# EAGLE design mini (EAGLE 9.6.2)
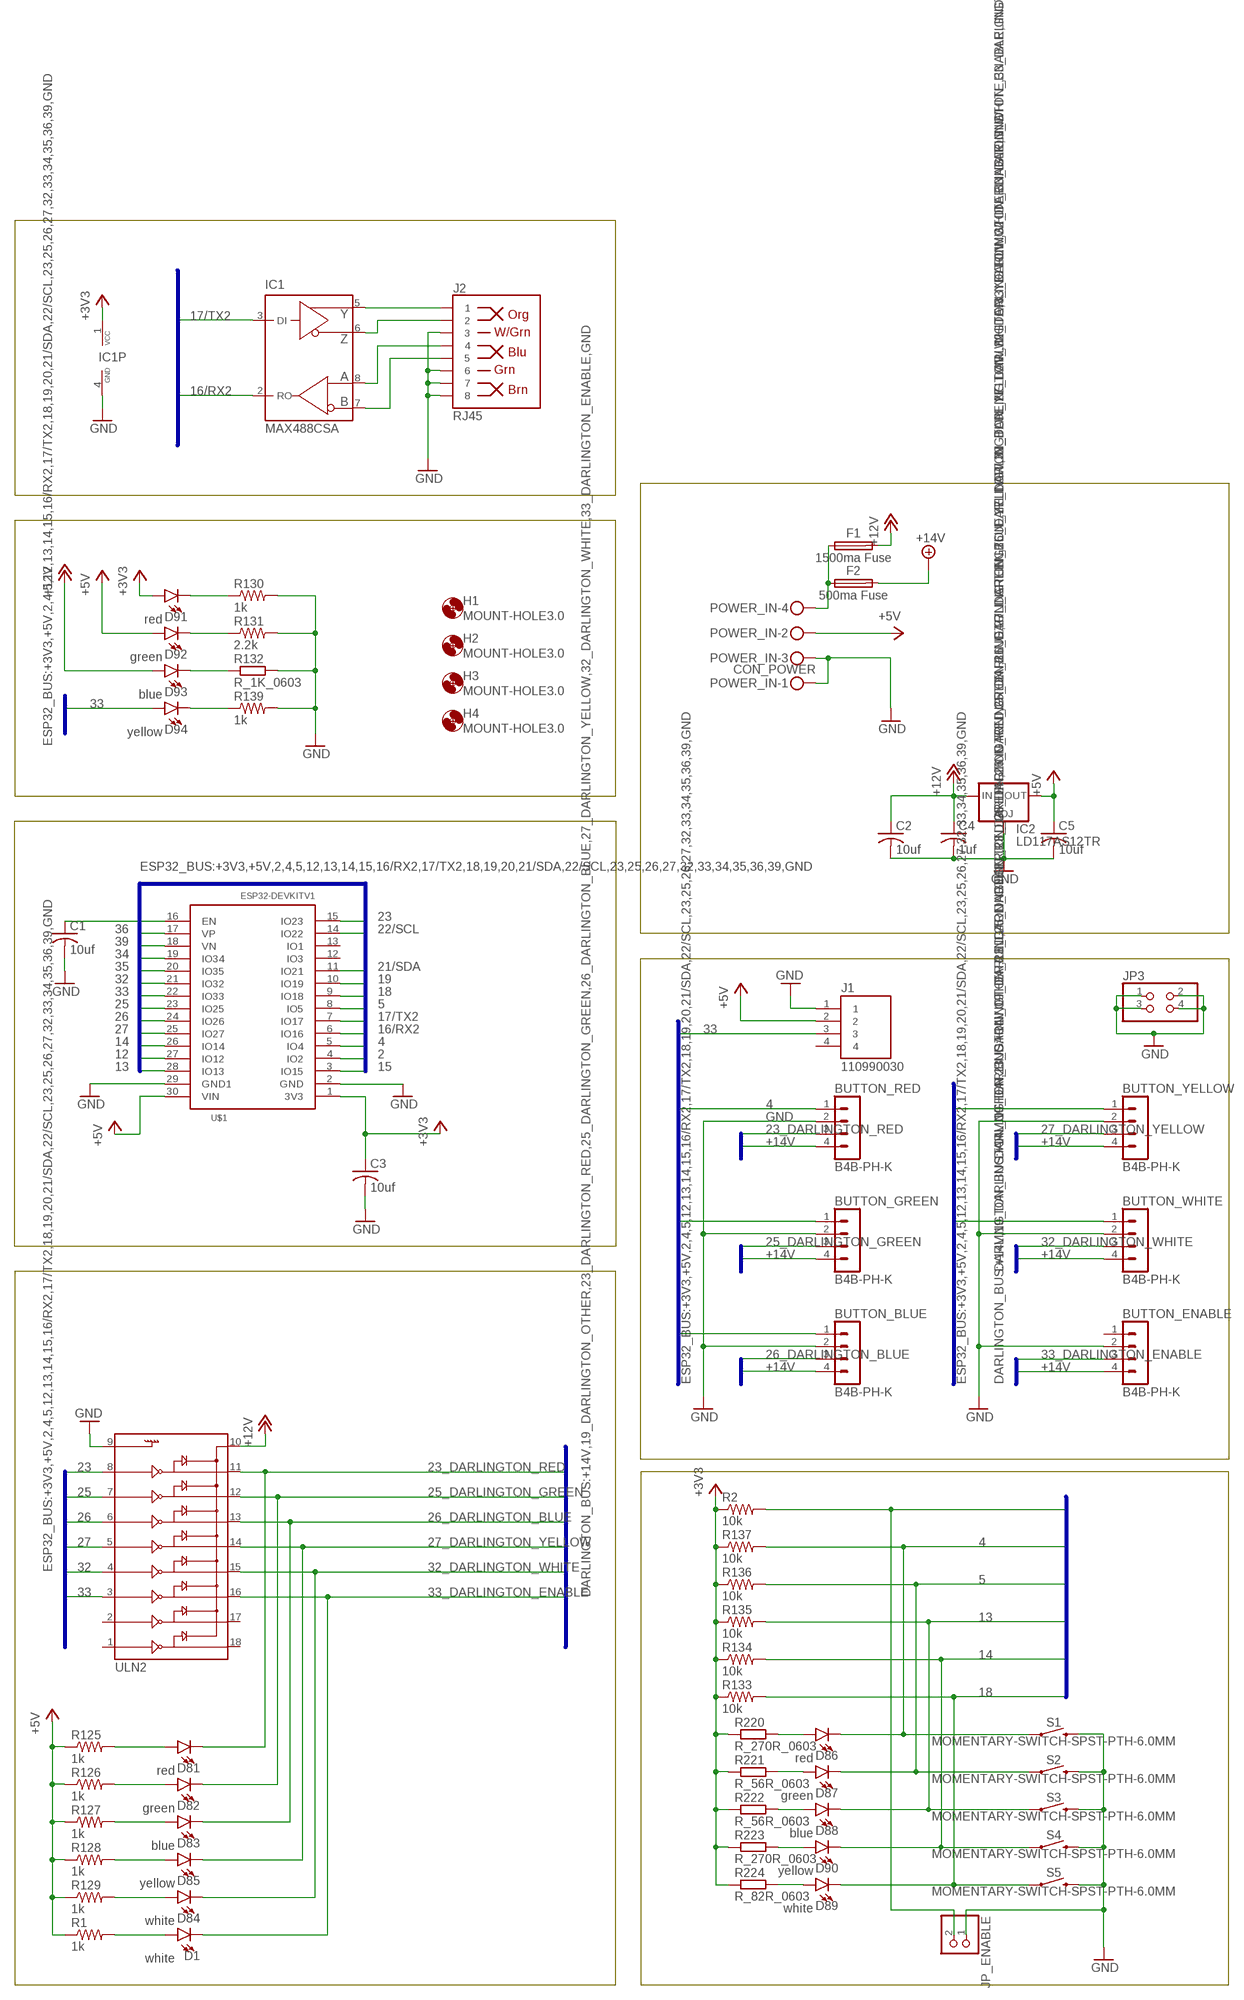
[diagram p0: schematic, sheet 1]

## Parts
BUTTON_BLUE  B4B-PH-K  [B4B-PH-K]
BUTTON_ENABLE  B4B-PH-K  [B4B-PH-K]
BUTTON_GREEN  B4B-PH-K  [B4B-PH-K]
BUTTON_RED  B4B-PH-K  [B4B-PH-K]
BUTTON_WHITE  B4B-PH-K  [B4B-PH-K]
BUTTON_YELLOW  B4B-PH-K  [B4B-PH-K]
C1  10uf  C-USC0603  [C0603]
C2  10uf  C-USC0603  [C0603]
C3  10uf  C-USC0603  [C0603]
C4  1uf  C-USC0805  [C0805]
C5  10uf  C-USC0603  [C0603]
D1  white  LED0603  [LED-0603]
D81  red  LED0603  [LED-0603]
D82  green  LED0603  [LED-0603]
D83  blue  LED0603  [LED-0603]
D84  white  LED0603  [LED-0603]
D85  yellow  LED0603  [LED-0603]
D86  red  LED0603  [LED-0603]
D87  green  LED0603  [LED-0603]
D88  blue  LED0603  [LED-0603]
D89  white  LED0603  [LED-0603]
D90  yellow  LED0603  [LED-0603]
D91  red  LED0603  [LED-0603]
D92  green  LED0603  [LED-0603]
D93  blue  LED0603  [LED-0603]
D94  yellow  LED0603  [LED-0603]
F1  1500ma Fuse  MF-MSMF-STYLE2_1  [FUSC4632X160]
F2  500ma Fuse  MF-MSMF-STYLE2_1  [FUSC4632X160]
H1  MOUNT-HOLE3.0  [3,0]
H2  MOUNT-HOLE3.0  [3,0]
H3  MOUNT-HOLE3.0  [3,0]
H4  MOUNT-HOLE3.0  [3,0]
IC1  MAX488CSA  [SO08]
IC2  LD117AS12TR  [SOT223]
J1  110990030  [SEEED_110990030]
J2  RJ45  RJ45-8  [RJ45-8]
JP3  PINHD-2X2  [2X02]
JP_ENABLE  PINHD-1X2  [1X02]
POWER_IN  CON_POWER  MKDSN1,5/4-5,08  [MKDSN1,5/4-5,08]
R1  1k  R-US_R0603  [R0603]
R2  10k  R-US_R0603  [R0603]
R125  1k  R-US_R0603  [R0603]
R126  1k  R-US_R0603  [R0603]
R127  1k  R-US_R0603  [R0603]
R128  1k  R-US_R0603  [R0603]
R129  1k  R-US_R0603  [R0603]
R130  1k  R-US_R0603  [R0603]
R131  2.2k  R-US_R0603  [R0603]
R132  R_1K_0603  [R0603]
R133  10k  R-US_R0603  [R0603]
R134  10k  R-US_R0603  [R0603]
R135  10k  R-US_R0603  [R0603]
R136  10k  R-US_R0603  [R0603]
R137  10k  R-US_R0603  [R0603]
R139  1k  R-US_R0603  [R0603]
R220  R_270R_0603  [R0603]
R221  R_56R_0603  [R0603]
R222  R_56R_0603  [R0603]
R223  R_270R_0603  [R0603]
R224  R_82R_0603  [R0603]
S1  MOMENTARY-SWITCH-SPST-PTH-6.0MM  [TACTILE_SWITCH_PTH_6.0MM]
S2  MOMENTARY-SWITCH-SPST-PTH-6.0MM  [TACTILE_SWITCH_PTH_6.0MM]
S3  MOMENTARY-SWITCH-SPST-PTH-6.0MM  [TACTILE_SWITCH_PTH_6.0MM]
S4  MOMENTARY-SWITCH-SPST-PTH-6.0MM  [TACTILE_SWITCH_PTH_6.0MM]
S5  MOMENTARY-SWITCH-SPST-PTH-6.0MM  [TACTILE_SWITCH_PTH_6.0MM]
U$1  ESP32DEVKITV1  [ESP32-DEVKITV1]
ULN2  ULN2803SOICW  [SO18L]

## Nets
2: U$1.4(IO2)
4: BUTTON_RED.1 D86.C R137.2 S1.1 U$1.5(IO4)
5: BUTTON_GREEN.1 D87.C R136.2 S2.1 U$1.8(IO5)
12: U$1.27(IO12)
13 [3V3]: BUTTON_BLUE.1 D88.C R135.2 S3.1 U$1.28(IO13)
14: BUTTON_YELLOW.1 D90.C R134.2 S4.1 U$1.26(IO14)
15: U$1.3(IO15)
16/RX2: IC1.2(RO) U$1.6(IO16)
17/TX2: IC1.3(DI) U$1.7(IO17)
18: BUTTON_WHITE.1 D89.C R133.2 S5.1 U$1.9(IO18)
19: JP_ENABLE.2 R2.2 U$1.10(IO19)
21/SDA: U$1.11(IO21)
22/SCL: U$1.14(IO22)
23: U$1.15(IO23) ULN2.8
23_DARLINGTON_RED: BUTTON_RED.3 D81.C ULN2.11
25: U$1.23(IO25) ULN2.7
25_DARLINGTON_GREEN: BUTTON_GREEN.3 D82.C ULN2.12
26: U$1.24(IO26) ULN2.6
26_DARLINGTON_BLUE: BUTTON_BLUE.3 D83.C ULN2.13
27: U$1.25(IO27) ULN2.5
27_DARLINGTON_YELLOW: BUTTON_YELLOW.3 D85.C ULN2.14
32: U$1.21(IO32) ULN2.4
32_DARLINGTON_WHITE: BUTTON_WHITE.3 D84.C ULN2.15
33: D94.A J1.3 U$1.22(IO33) ULN2.3
33_DARLINGTON_ENABLE: BUTTON_ENABLE.3 D1.C ULN2.16
34: U$1.19(IO34)
35: U$1.20(IO35)
36: U$1.17(VP)
39: U$1.18(VN)
+3V3 [3V3]: C3.1 D91.A IC1.1(VCC) R2.1 R133.1 R134.1 R135.1 R136.1 R137.1 R220.1 R221.1 R222.1 R223.1 R224.1 U$1.1(3V3)
+5V [5V]: C5.1 D92.A IC2.4(OUT) J1.2 POWER_IN.2 R1.1 R125.1 R126.1 R127.1 R128.1 R129.1 U$1.30(VIN)
+12V [12V]: C2.1 C4.1 D93.A F1.2 IC2.3(IN) ULN2.10
+14V [12V]: BUTTON_BLUE.4 BUTTON_ENABLE.4 BUTTON_GREEN.4 BUTTON_RED.4 BUTTON_WHITE.4 BUTTON_YELLOW.4 F2.2
GND [GND]: BUTTON_BLUE.2 BUTTON_ENABLE.2 BUTTON_GREEN.2 BUTTON_RED.2 BUTTON_WHITE.2 BUTTON_YELLOW.2 C1.2 C2.2 C3.2 C4.2 C5.2 IC1.4(GND) IC2.1(ADJ) J1.1 J2.3 J2.6 J2.7 J2.8 JP3.1 JP3.2 JP3.3 JP3.4 JP_ENABLE.1 POWER_IN.1 POWER_IN.3 R130.2 R131.2 R132.2 R139.2 S1.3 S2.3 S3.3 S4.3 S5.3 U$1.2(GND) U$1.29(GND1) ULN2.9
N$1: C1.1 U$1.16(EN)
N$2: D1.A R1.2
N$3: IC1.5(Y) J2.1
N$4: IC1.6(Z) J2.2
N$5: IC1.8(A) J2.4
N$6: IC1.7(B) J2.5
N$151: D84.A R129.2
N$152: D85.A R128.2
N$153: D83.A R127.2
N$154: D82.A R126.2
N$155: D81.A R125.2
N$156: D91.C R130.1
N$157: D92.C R131.1
N$158: D93.C R132.1
N$159: D94.C R139.1
N$320: D86.A R220.2
N$321: D87.A R221.2
N$322: D88.A R222.2
N$323: D90.A R223.2
N$324: D89.A R224.2
N$346 [12V]: F1.1 F2.1 POWER_IN.4
Unconnected: BUTTON_ENABLE.1 J1.4 U$1.12(IO3) U$1.13(IO1) ULN2.1 ULN2.2 ULN2.17 ULN2.18

## Buses
ESP32_BUS:+3V3,+5V,2,4,5,12,13,14,15,16/RX2,17/TX2,18,19,20,21/SDA,22/SCL,23,25,26,27,32,33,34,35,36,39,GND
DARLINGTON_BUS:+14V,19_DARLINGTON_OTHER,23_DARLINGTON_RED,25_DARLINGTON_GREEN,26_DARLINGTON_BLUE,27_DARLINGTON_YELLOW,32_DARLINGTON_WHITE,33_DARLINGTON_ENABLE,GND

## Library data of the parts
BUTTON_BLUE BUTTON_ENABLE BUTTON_GREEN BUTTON_RED BUTTON_WHITE BUTTON_YELLOW = con-jst-ph:B4B-PH-K: HEADER
C1-C3 C5 = rcl:C-US: CAPACITOR, American symbol; LCSC_PART: C19702; SPICEPREFIX: C
C4 = rcl:C-US: CAPACITOR, American symbol; LCSC_PART: C15849; SPICEPREFIX: C
D1 D84 D89 = SparkFun-LED:LED: LED (Generic) Standard schematic elements and footprints for 5mm, 3mm, 1206, and 0603 sized LEDs. Generic LEDs with no color specified.; LCSC_PART: C2290
D81 D86 D91 = SparkFun-LED:LED: LED (Generic) Standard schematic elements and footprints for 5mm, 3mm, 1206, and 0603 sized LEDs. Generic LEDs with no color specified.; LCSC_PART: C2286
D82 D87 D92 = SparkFun-LED:LED: LED (Generic) Standard schematic elements and footprints for 5mm, 3mm, 1206, and 0603 sized LEDs. Generic LEDs with no color specified.; LCSC_PART: C72043
D83 D88 D93 = SparkFun-LED:LED: LED (Generic) Standard schematic elements and footprints for 5mm, 3mm, 1206, and 0603 sized LEDs. Generic LEDs with no color specified.; LCSC_PART: C72041
D85 D90 D94 = SparkFun-LED:LED: LED (Generic) Standard schematic elements and footprints for 5mm, 3mm, 1206, and 0603 sized LEDs. Generic LEDs with no color specified.; LCSC_PART: C72038
F1 = Fuse:MF-MSMF: PTC Resettable Fuses Datasheet <https://www.bourns.com/docs/Product-Datasheets/mfmsmf.pdf?sfvrsn=26>; CATEGORY: FUSE; DESCRIPTION: PTC Resettable Fuses; LCSC_PART: C78695; MANUFACTURER: BOURNS; MPN: MF-MSMF; OPERATING_TEMPERATURE: -40 °C to +85 °C; PART_STATUS: Active; ROHS_COMPLIANCE: RoHS Compliant; SERIES: MF-MSMF; SUB-CATEGORY: Resettable; TYPE: PTC
F2 = Fuse:MF-MSMF: PTC Resettable Fuses Datasheet <https://www.bourns.com/docs/Product-Datasheets/mfmsmf.pdf?sfvrsn=26>; CATEGORY: FUSE; DESCRIPTION: PTC Resettable Fuses; LCSC_PART: C70113; MANUFACTURER: BOURNS; MPN: MF-MSMF; OPERATING_TEMPERATURE: -40 °C to +85 °C; PART_STATUS: Active; ROHS_COMPLIANCE: RoHS Compliant; SERIES: MF-MSMF; SUB-CATEGORY: Resettable; TYPE: PTC
H1-H4 = holes:MOUNT-HOLE: MOUNTING HOLE with drill center marker
IC1 = maxim:MAX488: RS485 TRANSEIVER Source: Data sheet <http://datasheets.maxim-ic.com/en/ds/MAX1487-MAX491.pdf>; LCSC_PART: C179693; MF: MAXIM; MPN: MAX488CSA; OC_FARNELL: 3534170; OC_NEWARK: 34C3921
IC2 = v-reg:LD117A?*: Low drop fixed and adjustable positive voltage regulators 1 A Source: http://www.st.com/stonline/products/literature/ds/7194/ld1117axx.pdf; LCSC_PART: C6187; PRICE: 0.5
J1 = GROVE 2MM 4PIN VERT CONN:110990030: Check availability <https://pricing.snapeda.com/parts/110990030/Seeed%20Technology/view-part?ref=eda>; AVAILABILITY: In Stock; CHECK_PRICES: https://www.snapeda.com/parts/110990030/Seeed+Studio/view-part/?ref=eda; DESCRIPTION: GROVE 2MM 4PIN VERT CONN 10PCS; MF: Seeed Technology; MP: 110990030; PACKAGE: None; PRICE: None; SNAPEDA_LINK: https://www.snapeda.com/parts/110990030/Seeed+Studio/view-part/?ref=snap
J2 = SparkFun-Connectors:RJ45-8: RJ45 Jack - 8 pin Simple RJ45, 8-pin connection. Commonly used for Cat5, Cat5e, and Cat6 Ethernet cables. Here is the connector we sell at SparkFun: RJ45 8-Pin Connector <https://www.sparkfun.com/products/643> (PRT-00643) Datasheet <https://cdn.sparkfun.com/datasheets/Prototyping/04908.pdf> It is used on this SparkFun product: SparkFun RJ45 Breakout <https://www.sparkfun.com/products/716> (BOB-00716) Note, you may also be interested in the "MAGJACK" version of this. It is basically a RJ45 connector, but also has some status LEDs built into the connector housing. You can check that out in this library at the device named "MAGJACK.dev" and see these products online: RJ45 Ethernet MagJack-Compatible <https://www.sparkfun.com/products/8534> (PRT-08534) SparkFun RJ45 MagJack Breakout <https://www.sparkfun.com/products/13021> (BOB-13021); PROD_ID: CONN-08506; SF_ID: PRT-00643
JP3 = pinhead:PINHD-2X2: PIN HEADER
JP_ENABLE = pinhead:PINHD-1X2: PIN HEADER
POWER_IN = con-phoenix-508-jm:MKDSN1,5/4-5,08: MKDSN 1,5/ 4-5,08 Printklemme Nennstrom: 13,5 A Nennspannung: 250 V Rastermaß: 5,08 mm Polzahl: 4 Anschlussart: Schraubanschluss Montage: Löten Anschlussrichtung Leiter/Platine: 0 ° Artikelnummer: 1729144 Source: http://eshop.phoenixcontact.com .. 1729144.pdf
R1 R125-R130 R139 = rcl:R-US_: RESISTOR, American symbol; LCSC_PART: C21190; SPICEPREFIX: R
R2 R133-R137 = rcl:R-US_: RESISTOR, American symbol; LCSC_PART: C25804; SPICEPREFIX: R
R131 = rcl:R-US_: RESISTOR, American symbol; LCSC_PART: C4190; SPICEPREFIX: R
R132 = JLC PCB Basic Parts_loc:R_: Resistor General purpose SMD Resistor; LCSC_DATASHEET: https://datasheet.lcsc.com/lcsc/2110252030_UNI-ROYAL-Uniroyal-Elec-0603WAF1001T5E_C21190.pdf; LCSC_PART: C21190; LCSC_ROTATION_CCW: 0; LCSC_STOCK: 5175299; PROPERTIES: ±1% 1/10W Thick Film Resistors 75V ±100ppm -55°C~+155°C 1kOhm 0603 ROHS
R220 R223 = JLC PCB Basic Parts_loc:R_: Resistor General purpose SMD Resistor; LCSC_DATASHEET: https://datasheet.lcsc.com/lcsc/2110252130_UNI-ROYAL-Uniroyal-Elec-0603WAF2700T5E_C22966.pdf; LCSC_PART: C22966; LCSC_ROTATION_CCW: 0; LCSC_STOCK: 315292; PROPERTIES: ±1% 1/10W Thick Film Resistors 75V ±100ppm -55°C~+155°C 270Ohm 0603 ROHS
R221 R222 = JLC PCB Basic Parts_loc:R_: Resistor General purpose SMD Resistor; LCSC_DATASHEET: https://datasheet.lcsc.com/lcsc/2110252230_UNI-ROYAL-Uniroyal-Elec-0603WAF560JT5E_C25196.pdf; LCSC_PART: C25196; LCSC_ROTATION_CCW: 0; LCSC_STOCK: 82739; PROPERTIES: ±1% 1/10W Thick Film Resistors 75V ±200ppm -55°C~+155°C 56Ohm 0603 ROHS
R224 = JLC PCB Basic Parts_loc:R_: Resistor General purpose SMD Resistor; LCSC_DATASHEET: https://datasheet.lcsc.com/lcsc/2110252230_UNI-ROYAL-Uniroyal-Elec-0603WAF820JT5E_C23255.pdf; LCSC_PART: C23255; LCSC_ROTATION_CCW: 0; LCSC_STOCK: 149533; PROPERTIES: ±1% 1/10W Thick Film Resistors 75V ±100ppm -55°C~+155°C 82Ohm 0603 ROHS
S1-S5 = SparkFun-Switches:MOMENTARY-SWITCH-SPST: Momentary Switch (Pushbutton) - SPST Normally-open (NO) SPST momentary switches (buttons, pushbuttons). Variants PTH-12MM - 12mm square, through-hole Momentary Pushbutton Switch - 12mm Square <https://www.sparkfun.com/products/9190> (COM-09190) PTH-6.0MM, PTH-6.0MM-KIT - 6.0mm square, through-hole Mini Pushbutton Switch <https://www.sparkfun.com/products/97> (COM-00097) KIT package intended for soldering kit's - only one side of pads' copper is exposed. PTH-RIGHT-ANGLE-KIT - Right-angle, through-hole Right Angle Tactile Button <https://www.sparkfun.com/products/10791> - Used on SparkFun BigTime Watch Kit <https://www.sparkfun.com/products/11734> SMD-12MM - 12mm square, surface-mount Tactile Button - SMD (12mm) <https://www.sparkfun.com/products/12993> (COM-12993) Used on SparkFun PicoBoard <https://www.sparkfun.com/products/11888> SMD-4.5MM - 4.5mm Square Trackball Switch Used on SparkFun Blackberry Trackballer Breakout <https://www.sparkfun.com/products/13169> SMD-4.6MMX2.8MM - 4.60mm x 2.80mm, surface mount Used on SparkFun SAMD21 Mini Breakout <https://www.sparkfun.com/products/13664> SMD-5.2MM, SMD-5.2-REDUNDANT - 5.2mm square, surface-mount Mini Pushbutton Switch - SMD <https://www.sparkfun.com/products/8720> (COM-08720) Used on Arduino Pro Mini <https://www.sparkfun.com/products/11114> REDUNDANT package connects both switch circuits together SMD-6.0X3.5MM - 6.0 x 3.5mm, surface mount Momentary Reset Switch SMD <https://www.sparkfun.com/products/8229> (COM-08229) SMD-6.2MM-TALL - 6.2mm square, surface mount Tactile Button - SMD (6mm) <https://www.sparkfun.com/products/12992> Used on SparkFun Digital Sandbox <https://www.sparkfun.com/products/12651> SMD-RIGHT-ANGLE - Right-angle, surface mount Used on SparkFun Block for Intel® Edison - Arduino <https://www.sparkfun.com/products/13036>; PROD_ID: SWCH-08441; SF_SKU: COM-00097
U$1 = ESP32-DEVKITV1:ESP32DEVKITV1
ULN2 = SparkFun-IC-Special-Function:ULN2803: Darlington Driver(IC-07959, low stock) ULN2803 Darlington array. 500mA max per channel, 8-channel package. Spark Fun Electronics SKU : COM-00312

## Net classes
0 default: width 0.305 mm, clearance 0.305 mm
1 GND: width 0.508 mm, clearance 0.305 mm
2 12V: width 1.27 mm, clearance 0.305 mm
3 5V: width 0.508 mm, clearance 0.305 mm
4 3V3: width 0.508 mm, clearance 0.305 mm

## Board
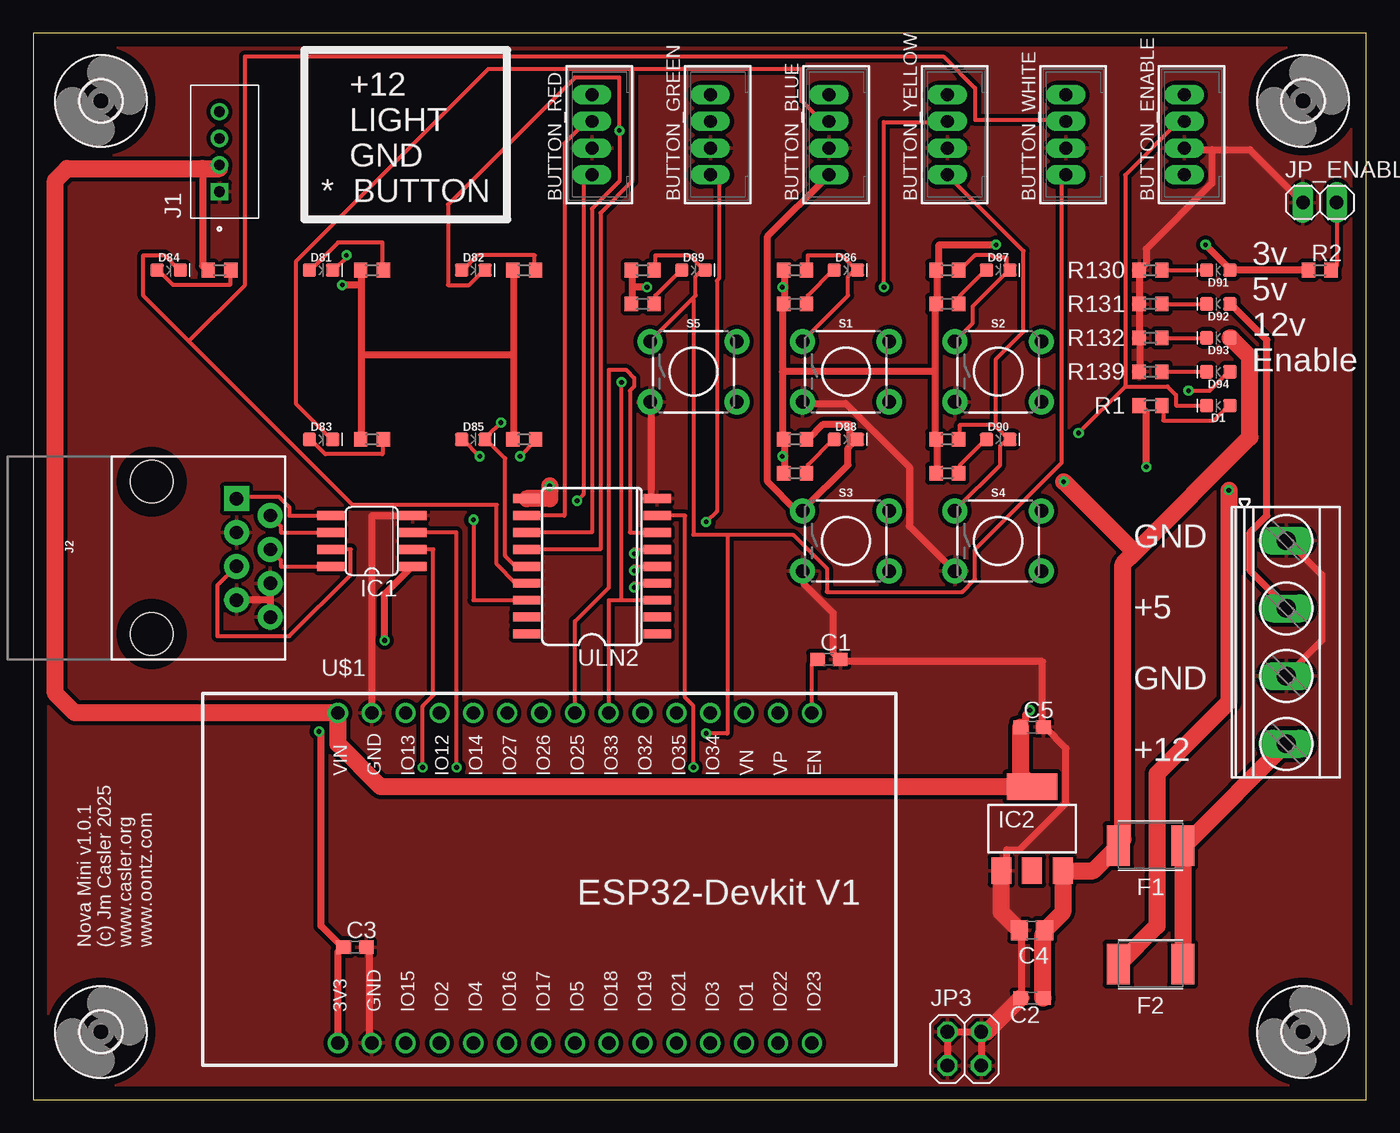
[diagram p1: board, top side]
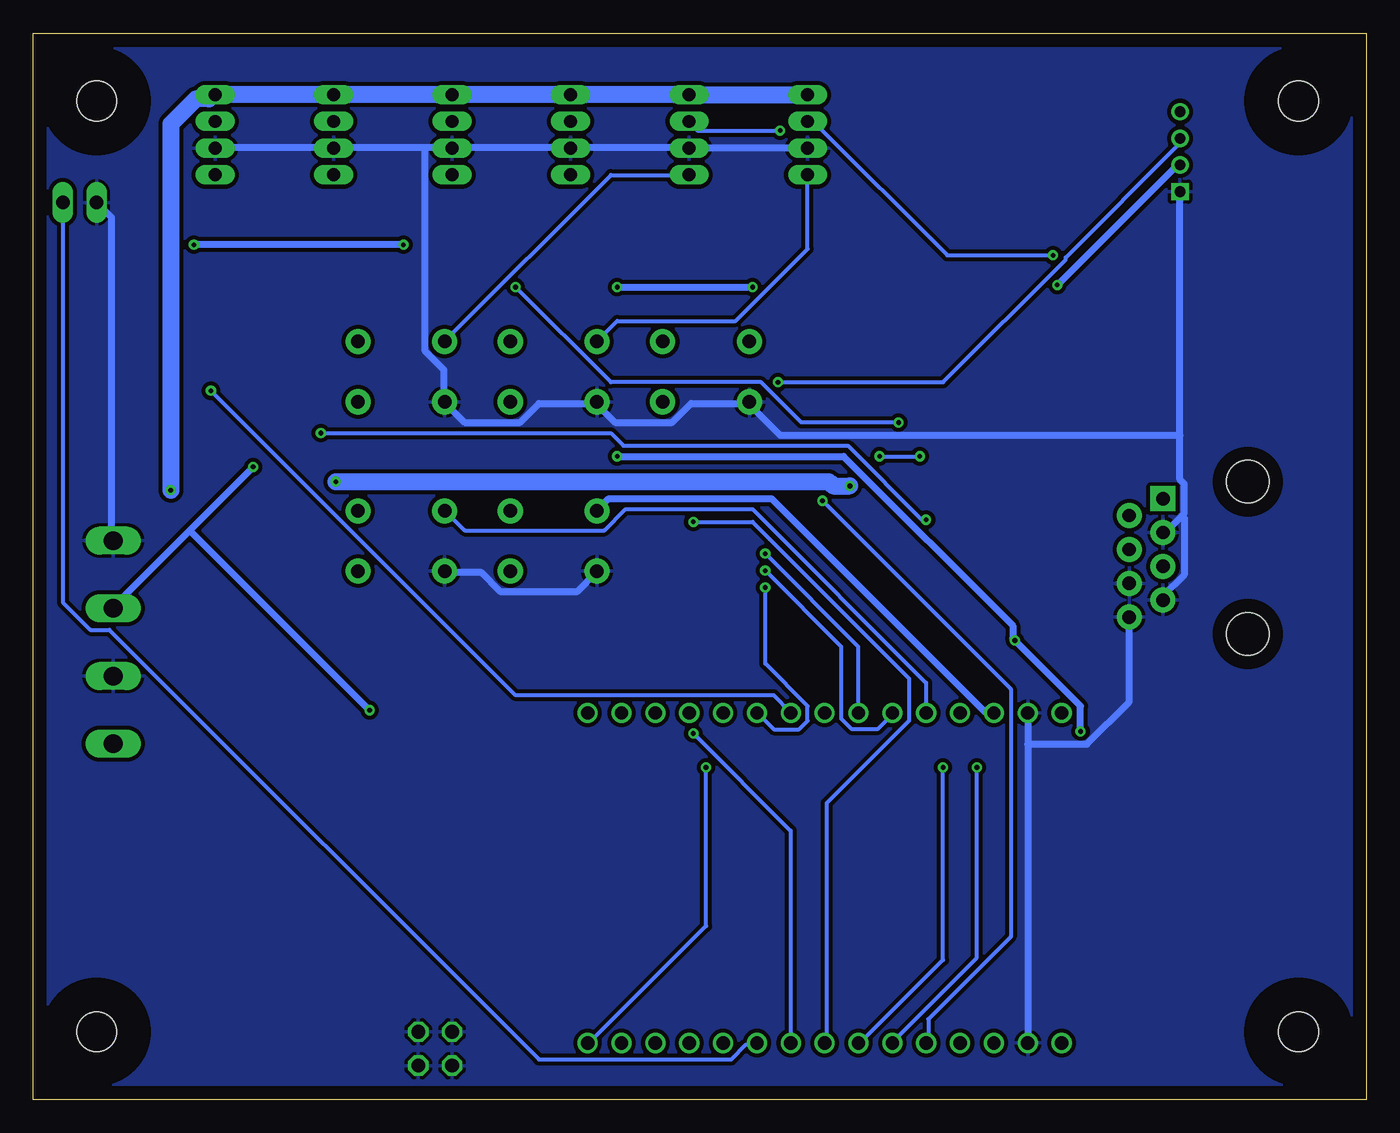
[diagram p2: board, bottom side, seen from below]

Size 100 x 80 mm. Coordinates in mm from the lower left corner, seen from the top.
Outline: 0,0 100,0 100,80 0,80 0,0
Copper layers (1*16): Top 0.035mm / dielectric 1.5mm / Bottom 0.035mm
Design rules "default": minimum track width 6mil, minimum drill 0.35mm, track to track 6mil, track to pad 6mil, pad to pad 6mil, via to via 6mil, smd to smd 6mil, copper to edge 40mil, drill to drill 6mil, minimum pad ring 10mil, minimum via ring 8mil, stop-mask expansion 4mil, vias tented up to drill 0mil, thermal gap 10mil

### Footprints (pad centres in the part's own frame; a part is rotated, then mirrored left to right if it is on the bottom)
B4B-PH-K = drill 0.965 long: 1 -3,0; 2 -1,0; 3 1,0; 4 3,0
C0603 = smd 1.1 x 1: 1 -0.85,0; 2 0.85,0
C0805 = smd 1.3 x 1.5: 1 -0.95,0; 2 0.95,0
LED-0603 = smd 1 x 1: A -0.877,0; C 0.877,0
FUSC4632X160 = smd 1.73 x 3.05: 1 -2.415,0; 2 2.415,0
3,0 = hole 3: 0,0
SO08 = smd 0.66 x 2.032: 1 -1.905,-3.073; 2 -0.635,-3.073; 3 0.635,-3.073; 4 1.905,-3.073; 5 1.905,3.073; 6 0.635,3.073; 7 -0.635,3.073; 8 -1.905,3.073
SOT223 = smd 1.5 x 2: 1 -2.3,-3.15; 2 0,-3.15; 3 2.3,-3.15 | smd 3.8 x 2: 4 0,3.15
SEEED_110990030 = drill 0.8 square: 1 -3,0 | drill 0.8: 2 -1,0; 3 1,0; 4 3,0
RJ45-8 = drill 1 pad 1.88 square: 1 -4.445,6.35 | drill 1 pad 1.88: 2 -3.175,8.89; 3 -1.905,6.35; 4 -0.635,8.89; 5 0.635,6.35; 6 1.905,8.89; 7 3.175,6.35; 8 4.445,8.89 | hole 3.2: -5.715,0; 5.715,0
2X02 = drill 1.016 octagon: 1 -1.27,-1.27; 2 -1.27,1.27; 3 1.27,-1.27; 4 1.27,1.27
1X02 = drill 1.016 long: 1 -1.27,0; 2 1.27,0
MKDSN1,5/4-5,08 = drill 1.397 pad 2 long: 1 -7.641,0.025; 2 -2.561,0.025; 3 2.519,0.025; 4 7.599,0.025
R0603 = smd 1 x 1.1: 1 -0.85,0; 2 0.85,0
TACTILE_SWITCH_PTH_6.0MM = drill 1.016 pad 1.88: 1 -3.251,2.261; 2 3.251,2.261; 3 -3.251,-2.261; 4 3.251,-2.261
ESP32-DEVKITV1 = drill 1 pad 1.422: 1 -22.87,-13.54; 2 -20.33,-13.54; 3 -17.79,-13.54; 4 -15.25,-13.54; 5 -12.71,-13.54; 6 -10.17,-13.54; 7 -7.63,-13.54; 8 -5.09,-13.54; 9 -2.55,-13.54; 10 -0.01,-13.54; 11 2.53,-13.54; 12 5.07,-13.54; 13 7.61,-13.54; 14 10.15,-13.54; 15 12.69,-13.54; 16 12.69,11.23; 17 10.15,11.23; 18 7.61,11.23; 19 5.07,11.23; 20 2.53,11.23; 21 -0.01,11.23; 22 -2.55,11.23; 23 -5.09,11.23; 24 -7.63,11.23; 25 -10.17,11.23; 26 -12.71,11.23; 27 -15.25,11.23; 28 -17.79,11.23; 29 -20.33,11.23; 30 -22.87,11.23
SO18L = smd 0.66 x 2.032: 1 -0.635,-4.902; 2 0.635,-4.902; 3 1.905,-4.902; 4 3.175,-4.902; 5 4.445,-4.902; 6 5.715,-4.902; 7 6.985,-4.902; 8 8.255,-4.902; 9 9.525,-4.902; 10 9.525,4.902; 11 8.255,4.902; 12 6.985,4.902; 13 5.715,4.902; 14 4.445,4.902; 15 3.175,4.902; 16 1.905,4.902; 17 0.635,4.902; 18 -0.635,4.902

### Placement (x,y rotation side)
BUTTON_BLUE  59.69,72.39 90 top
BUTTON_ENABLE  86.36,72.39 90 top
BUTTON_GREEN  50.8,72.39 90 top
BUTTON_RED  41.91,72.39 90 top
BUTTON_WHITE  77.47,72.39 90 top
BUTTON_YELLOW  68.58,72.39 90 top
C1  59.69,33.02 0 top
C2  74.93,7.62 180 top
C3  24.13,11.43 0 top
C4  74.93,12.7 180 top
C5  74.93,27.94 0 top
D1  88.9,52.07 180 top
D81  21.59,62.23 0 top
D82  33.02,62.23 0 top
D83  21.59,49.53 0 top
D84  10.16,62.23 0 top
D85  33.02,49.53 0 top
D86  60.96,62.23 0 top
D87  72.39,62.23 0 top
D88  60.96,49.53 0 top
D89  49.53,62.23 0 top
D90  72.39,49.53 0 top
D91  88.9,62.23 180 top
D92  88.9,59.69 180 top
D93  88.9,57.15 180 top
D94  88.9,54.61 180 top
F1  83.82,19.05 180 top
F2  83.82,10.16 180 top
H1  95.25,74.93 0 top
H2  95.25,5.08 0 top
H3  5.08,5.08 0 top
H4  5.08,74.93 0 top
IC1  25.4,41.91 90 top
IC2  74.93,20.32 0 top
J1  13.97,71.12 90 top
J2  8.89,40.64 270 top
JP3  69.85,3.81 0 top
JP_ENABLE  96.52,67.31 0 top
POWER_IN  93.98,34.29 270 top
R1  83.82,52.07 0 top
R2  96.52,62.23 0 top
R125  25.4,62.23 0 top
R126  36.83,62.23 0 top
R127  25.4,49.53 0 top
R128  36.83,49.53 0 top
R129  13.97,62.23 0 top
R130  83.82,62.23 180 top
R131  83.82,59.69 180 top
R132  83.82,57.15 180 top
R133  45.72,62.23 0 top
R134  68.58,49.53 0 top
R135  57.15,49.53 0 top
R136  68.58,62.23 0 top
R137  57.15,62.23 0 top
R139  83.82,54.61 180 top
R220  57.15,59.69 0 top
R221  68.58,59.69 0 top
R222  57.15,46.99 0 top
R223  68.58,46.99 0 top
R224  45.72,59.69 0 top
S1  60.96,54.61 0 top
S2  72.39,54.61 0 top
S3  60.96,41.91 0 top
S4  72.39,41.91 0 top
S5  49.53,54.61 0 top
U$1  45.72,17.78 0 top
ULN2  41.91,35.56 90 top

### Tracks (layer width: path | path; a pad name or v marks a point on that pad's centre or on a via)
4  (via drill 0.35)
  Top 0.305: R137.2 58.1,62.23 58.1,63.34 60.64,63.34 61.75,62.23 D86.C 61.59,62.23 61.12,61.75 61.12,60.33 57.78,56.99 S1.1 | v40.8,44.93 41.27,45.4 41.27,68.74 41.91,69.37 BUTTON_RED.1
  Bottom 0.305: BUTTON_RED.1 41.91,63.82 47.31,58.42 56.2,58.42 57.63,56.99 S1.1 | v40.8,44.93 26.67,30.8 26.67,12.22 32.86,6.03 32.86,4.29 U$1.5
5  (via drill 0.35)
  Top 0.305: S2.1 69.22,56.99 70.48,58.26 70.48,59.53 73.18,62.23 D87.C 73.03,62.23 73.03,63.18 72.07,63.18 71.91,63.34 70.64,63.34 69.53,62.23 R136.2 | v50.48,43.34 51.28,44.13 51.28,61.44 51.44,61.59 51.44,68.74 50.8,69.37 BUTTON_GREEN.1
  Bottom 0.305: BUTTON_GREEN.1 50.8,69.37 56.67,69.37 69.06,56.99 S2.1 | v50.48,43.34 46.04,43.34 34.29,31.59 34.29,28.42 40.48,22.23 40.48,4.29 U$1.8
13
  Top 0.508: 61.44,49.21 61.12,48.9 61.12,47.62 57.78,44.29 S3.1 57.47,44.13 57.31,44.13 55.09,46.35 55.09,64.77 59.69,69.37 BUTTON_BLUE.1 | 61.44,49.21 61.75,49.53 D88.C | R135.2 58.1,49.53 59.21,50.64 61.28,50.64 61.28,49.37 61.44,49.21
  Bottom 0.508: U$1.28 27.94,29.05 28.57,29.05 44.61,45.09 56.83,45.09 57.63,44.29 S3.1
14
  Top 0.305: 72.15,50.56 72.07,50.64 69.53,50.64 69.53,49.53 R134.2 | 72.15,50.56 73.18,49.53 D90.C 73.03,49.53 72.55,49.05 72.55,47.62 69.22,44.29 S4.1 | BUTTON_YELLOW.1 68.58,69.37 74.3,63.66 74.3,57.63 72.23,55.56 72.23,50.64 72.15,50.56
  Bottom 0.305: U$1.26 33.02,29.05 33.02,31.27 46.04,44.29 55.56,44.29 57.15,42.7 67.63,42.7 69.06,44.13 S4.1
16/RX2  (via drill 0.35)
  Top 0.305: IC1.2 30,41.27 30,30.32 29.21,29.53 v29.21,24.92
  Bottom 0.305: v29.21,24.92 29.21,10.64 35.56,4.29 U$1.6
17/TX2  (via drill 0.35)
  Top 0.305: IC1.3 31.75,42.55 v31.75,24.92
  Bottom 0.305: v31.75,24.92 31.75,10.48 37.94,4.29 U$1.7
18  (via drill 0.35)
  Top 0.305: R133.2 46.67,62.23 46.67,63.34 49.21,63.34 50.32,62.23 D89.C 50.16,62.23 49.69,61.75 49.69,60.33 49.45,60.09 | 49.45,60.09 46.35,56.99 S5.1 | 52.07,42.39 49.53,42.39 49.53,60.01 49.45,60.09 | 52.07,42.39 56.99,42.39 59.53,39.85 59.53,38.1 69.69,38.1 70.64,39.05 70.64,41.27 77.15,47.78 77.15,69.06 77.47,69.37 BUTTON_WHITE.1 | v50.48,27.46 52.07,27.46 52.07,42.39
  Bottom 0.305: v50.48,27.46 43.18,20.16 43.18,4.29 U$1.9
19
  Top 0.305: JP_ENABLE.2 97.79,62.55 97.47,62.23 R2.2
  Bottom 0.305: JP_ENABLE.2 97.79,37.31 95.73,35.24 94.3,35.24 62.07,3.02 47.62,3.02 46.51,4.13 45.72,4.13 U$1.10
23  (via drill 0.35)
  Top 0.305: ULN2.8 48.9,43.81 48.9,30.16 49.53,29.53 v49.53,24.92
  Bottom 0.305: v49.53,24.92 49.53,13.02 58.26,4.29 U$1.15
23_DARLINGTON_RED  (via drill 0.35)
  Top 0.305: v23.5,63.34 23.5,63.18 22.54,62.23 D81.C | ULN2.11 39.85,43.81 39.85,71.75 41.43,73.34 41.91,73.34 BUTTON_RED.3
  Bottom 0.305: v23.5,63.34 31.43,63.34 41.43,73.34 41.91,73.34 BUTTON_RED.3
25
  Top 0.305: ULN2.7 44.77,42.55 44.77,53.18 45.09,53.5 45.09,54.13 44.45,54.77 43.18,54.77 43.18,38.42 40.64,35.88 40.64,29.05 U$1.23
25_DARLINGTON_GREEN  (via drill 0.35)
  Top 0.305: D82.C 33.81,62.23 32.7,61.12 31.11,61.12 31.11,67.15 40.64,76.68 43.97,76.68 v43.97,72.71 43.97,68.9 41.91,66.83 41.91,42.55 ULN2.12
  Bottom 0.305: v43.97,72.71 50.16,72.71 50.8,73.34 BUTTON_GREEN.3
26  (via drill 0.35)
  Top 0.305: ULN2.6 45.09,41.27 v45.09,40.96
  Bottom 0.305: v45.09,40.96 38.1,33.97 38.1,29.05 U$1.24
26_DARLINGTON_BLUE
  Top 0.305: 44.93,77.31 57.63,77.31 57.63,74.93 59.05,73.5 59.69,73.5 BUTTON_BLUE.3 | 44.93,77.31 34.13,77.31 19.68,62.87 19.68,52.23 22.38,49.53 D83.C | ULN2.13 42.55,41.27 42.55,66.52 44.93,68.9 44.93,77.31
27  (via drill 0.35)
  Top 0.305: ULN2.5 45.09,40.01 v45.09,39.69
  Bottom 0.305: v45.09,39.69 39.37,33.97 39.37,28.57 38.58,27.78 36.67,27.78 35.56,28.89 U$1.25
27_DARLINGTON_YELLOW  (via drill 0.35)
  Top 0.305: ULN2.14 36.2,40.01 35.4,40.8 35.4,48.1 33.97,49.53 D85.C 34.13,49.53 34.13,49.85 v35.08,50.8 | v63.82,60.96 63.82,73.34 68.58,73.34 BUTTON_YELLOW.3
  Bottom 0.305: v63.82,60.96 56.67,53.82 45.4,53.82 42.39,50.8 v35.08,50.8
32  (via drill 0.35)
  Top 0.305: ULN2.4 45.09,38.73 v45.09,38.42
  Bottom 0.305: v45.09,38.42 45.09,32.7 41.91,29.53 41.91,28.42 42.55,27.78 44.45,27.78 45.56,28.89 U$1.21
32_DARLINGTON_WHITE
  Top 0.305: 11.67,56.91 23.97,44.61 34.77,44.61 34.77,40.16 36.2,38.73 ULN2.15 | 11.67,56.91 8.26,60.33 8.26,63.34 9.84,63.34 10.95,62.23 D84.C | 11.67,56.91 15.88,61.12 15.88,78.26 68.26,78.26 70.64,75.88 70.64,73.5 77.47,73.5 BUTTON_WHITE.3
33  (via drill 0.35)
  Top 0.305: v86.68,53.18 88.27,53.18 89.69,54.61 D94.A | 44.13,37.47 43.18,37.47 43.18,29.05 U$1.22 | 44.13,37.47 ULN2.3 | 44.13,37.47 v44.13,53.82
  Bottom 0.305: v86.68,53.18 63.82,30.32 44.45,30.32 43.18,29.05 U$1.22 | J1.3 13.97,71.75 22.54,63.18 22.54,63.02 31.75,53.82 v44.13,53.82
33_DARLINGTON_ENABLE  (via drill 0.35)
  Top 0.305: D1.C 85.72,52.07 85.72,52.86 85.09,53.5 81.92,53.5 | 81.92,53.5 81.92,69.37 85.88,73.34 86.36,73.34 BUTTON_ENABLE.3 | ULN2.16 33.02,37.47 v33.02,43.5 | 81.92,53.5 v78.42,50.01
  Bottom 0.305: v33.02,43.5 33.34,43.5 38.89,49.05 55.72,49.05 56.67,50.01 v78.42,50.01
+3V3  (via drill 0.35)
  Top 0.508: U$1.1 22.86,4.29 22.86,11.11 23.18,11.43 C3.1 23.02,11.59 21.59,13.02 21.59,27.46 v21.43,27.62 | v26.35,34.45 26.35,37.94 28.42,40.01 IC1.1 | 44.93,60.96 44.93,62.23 R133.1 | 44.93,60.96 44.93,59.69 R224.1 | 56.36,48.26 56.36,49.53 R135.1 56.2,49.69 56.2,54.61 | 56.36,48.26 56.36,46.99 R222.1 | 56.36,60.96 56.36,62.23 R137.1 | 56.36,60.96 56.36,59.69 R220.1 56.2,59.53 56.2,54.61 | v46.04,60.96 44.93,60.96 | v56.2,60.96 56.36,60.96 | R2.1 D91.A 89.69,62.39 v87.95,64.14 | R223.1 67.79,46.99 67.79,49.53 R134.1 67.63,49.69 67.63,54.61 | 67.63,54.61 67.63,59.53 R221.1 67.79,59.69 67.79,62.23 R136.1 67.94,62.39 67.94,64.14 v72.23,64.14 | 67.63,54.61 56.2,54.61 | v56.2,48.26 56.36,48.26
  Bottom 0.508: v21.43,27.62 21.43,29.53 v26.35,34.45 26.51,34.61 26.51,35.56 39.21,48.26 v56.2,48.26 | v56.2,60.96 v46.04,60.96 | v72.23,64.14 v87.95,64.14
+5V  (via drill 0.35)
  Top 0.508: D92.A 89.85,59.69 92.55,56.99 92.55,43.81 91.28,42.55 91.28,39.69 93.98,36.99 POWER_IN.2 | v83.5,47.47 83.5,51.59 83.03,52.07 R1.1 | 36.04,55.88 36.04,62.23 R126.1 | 36.04,55.88 36.04,49.53 R128.1 | 12.7,69.85 12.7,62.55 13.02,62.23 R129.1 | 24.61,61.12 24.61,62.23 R125.1 | 24.61,61.12 24.61,55.88 | 24.61,55.88 24.61,49.53 R127.1 | 24.61,61.12 v23.18,61.12 | 24.61,55.88 36.04,55.88 | v74.77,29.21 74.45,28.89 74.45,28.42 C5.1
  Top 1.27: C5.1 74.08,24.32 IC2.4 26.06,23.47 22.85,26.68 U$1.30 3.12,29.01 1.65,30.48 1.65,68.96 2.54,69.85 12.7,69.85 13.97,69.85 J1.2
  Bottom 0.508: 88.27,42.7 93.98,36.99 POWER_IN.2 | 88.27,42.7 v83.5,47.47 | v23.18,61.12 14.29,70.01 13.97,70.01 J1.2 | v74.77,29.21 88.27,42.7
+12V  (via drill 0.35)
  Top 1.27: 82.63,41.04 81.76,40.16 81.76,19.53 F1.2 79.53,17.17 IC2.3 77.23,14.05 C4.1 75.72,12.22 75.72,7.62 C2.1 | 82.63,41.04 91.28,49.69 91.28,55.72 89.85,57.15 D93.A | ULN2.10 38.73,45.09 v38.73,46.04 | 82.63,41.04 v77.31,46.35
  Bottom 1.27: v38.73,46.04 40.01,46.04 40.32,46.35 v77.31,46.35
+14V  (via drill 0.35)
  Top 1.27: v89.69,45.72 89.69,29.84 84.3,24.45 84.3,13.02 81.44,10.16 F2.2
  Bottom 1.27: BUTTON_RED.4 41.91,75.41 50.8,75.41 BUTTON_GREEN.4 51.28,75.41 59.69,75.41 BUTTON_BLUE.4 60.17,75.41 68.58,75.41 BUTTON_YELLOW.4 69.06,75.41 77.47,75.41 BUTTON_WHITE.4 77.95,75.41 86.36,75.41 BUTTON_ENABLE.4 86.84,75.09 87.79,75.09 89.69,73.18 v89.69,45.72
GND
  Top 0.508: 17.78,37.47 J2.7 | J2.6 17.78,37.47 | 17.78,37.47 J2.8 | C3.2 25.08,11.43 25.24,11.27 25.24,4.29 U$1.2 | IC1.4 25.4,43.81 25.4,29.05 U$1.29 | S3.3 57.78,39.53 57.78,38.73 60.01,36.51 60.01,33.5 60.48,33.02 C1.2 60.64,32.86 75.72,32.86 75.72,28.1 C5.2 75.88,27.94 77.47,26.35 77.47,22.23 73.98,18.73 73.03,18.73 73.03,17.62 IC2.1 | JP3.3 JP3.4 JP3.2 JP3.1 | C2.2 74.14,8.1 74.14,12.22 C4.2 | ULN2.9 46.67,45.09 46.35,45.4 46.35,52.23 S5.3 | POWER_IN.3 94.14,31.91 96.68,34.45 96.68,39.37 94.14,41.91 POWER_IN.1 | R139.2 83.03,54.61 83.03,57.15 R132.2 83.03,57.31 83.03,59.69 R131.2 83.03,59.85 83.03,62.23 R130.2 83.19,62.39 83.5,62.71 83.5,63.82 88.42,68.74 88.42,71.28 | JP_ENABLE.1 91.28,71.28 88.42,71.28 | 88.42,71.28 86.36,71.28 BUTTON_ENABLE.2 | S4.3 69.06,39.69 65.72,43.02 65.72,47.47 60.96,52.23 57.78,52.23 S1.3
  Top 1.27: C2.2 71.54,5.08 JP3.4 | C4.2 72.63,14.05 IC2.1
  Bottom 0.508: 13.97,49.85 13.97,46.51 13.65,46.2 13.65,43.97 13.81,43.81 | 13.97,49.85 J1.1 | 13.81,43.81 15.08,42.55 J2.3 | J2.7 15.24,37.78 13.65,39.37 13.65,43.66 13.81,43.81 | 25.4,26.67 25.4,28.89 U$1.29 | 25.4,26.67 25.4,4.29 U$1.2 | J2.8 17.78,29.84 20.95,26.67 25.4,26.67 | S4.3 69.06,39.53 66.36,39.53 64.93,38.1 59.21,38.1 57.78,39.53 S3.3 | BUTTON_RED.2 41.91,71.44 50.8,71.44 BUTTON_GREEN.2 50.96,71.44 59.69,71.44 BUTTON_BLUE.2 59.85,71.44 68.58,71.44 BUTTON_YELLOW.2 68.74,71.44 70.64,71.44 | 70.64,71.44 77.47,71.44 BUTTON_WHITE.2 77.63,71.44 86.36,71.44 BUTTON_ENABLE.2 | JP_ENABLE.1 94.14,66.2 94.14,42.07 POWER_IN.1 | 70.64,71.44 70.64,56.2 69.22,54.77 69.22,52.55 S2.3 69.06,52.23 67.63,50.8 63.5,50.8 62.07,52.23 57.78,52.23 S1.3 57.63,52.07 56.36,50.8 52.07,50.8 50.64,52.23 46.35,52.23 S5.3 46.2,52.07 43.97,49.85 13.97,49.85
  pour Top: -1.27,81.28 101.6,81.28 101.6,-1.27 -1.27,-1.27
  pour Bottom: -2.54,82.55 102.87,82.55 102.87,-2.54 -2.54,-2.54
N$1
  Top 0.305: C1.1 58.74,33.02 58.42,32.7 58.42,29.05 U$1.16
N$2
  Top 0.305: D1.A 89.69,52.07 88.58,50.96 84.77,50.96 84.77,52.07 R1.2
N$3
  Top 0.305: IC1.5 19.21,43.81 19.21,44.45 18.41,45.24 15.24,45.24 J2.1
N$4
  Top 0.305: IC1.6 18.57,42.55 18.57,43.02 J2.2
N$5
  Top 0.305: IC1.8 18.57,40.01 18.57,40.48 J2.4
N$6
  Top 0.305: IC1.7 23.81,41.27 23.81,39.37 19.21,34.77 13.81,34.77 13.81,38.58 J2.5
N$151
  Top 0.305: D84.A 9.37,62.23 10.48,61.12 14.76,61.12 14.76,62.23 R129.2
N$152  (via drill 0.35)
  Top 0.305: v33.5,48.26 32.23,49.53 D85.A | v36.51,48.26 37.62,49.37 37.62,49.53 R128.2
  Bottom 0.305: v36.51,48.26 v33.5,48.26
N$153
  Top 0.305: D83.A 20.8,49.53 21.91,48.42 26.19,48.42 26.19,49.53 R127.2
N$154
  Top 0.305: D82.A 32.23,62.23 33.34,63.34 37.62,63.34 37.62,62.23 R126.2
N$155
  Top 0.305: D81.A 20.8,62.23 22.86,64.29 26.19,64.29 26.19,62.23 R125.2
N$156
  Top 0.305: R130.1 D91.C
N$157
  Top 0.305: R131.1 D92.C
N$158
  Top 0.305: R132.1 D93.C
N$159
  Top 0.305: R139.1 D94.C
N$320
  Top 0.305: D86.A 60.01,62.23 58.1,60.33 58.1,59.69 R220.2
N$321
  Top 0.305: D87.A 71.44,62.23 69.53,60.33 69.53,59.69 R221.2
N$322
  Top 0.305: D88.A 60.01,49.53 58.1,47.62 58.1,46.99 R222.2
N$323
  Top 0.305: D90.A 71.44,49.53 69.53,47.62 69.53,46.99 R223.2
N$324
  Top 0.305: D89.A 48.58,62.23 46.67,60.33 46.67,59.69 R224.2
N$346
  Top 1.27: F2.1 F1.1 86.68,19.37 93.98,26.67 POWER_IN.4

### Text on the board
tPlace: +12 / LIGHT / GND / * BUTTON | 3v / 5v / 12v / Enable | GND / / +5 / / GND / / +12 | Nova Mini v1.0.1 / (c) Jm Casler 2025 / www.casler.org / www.oontz.com